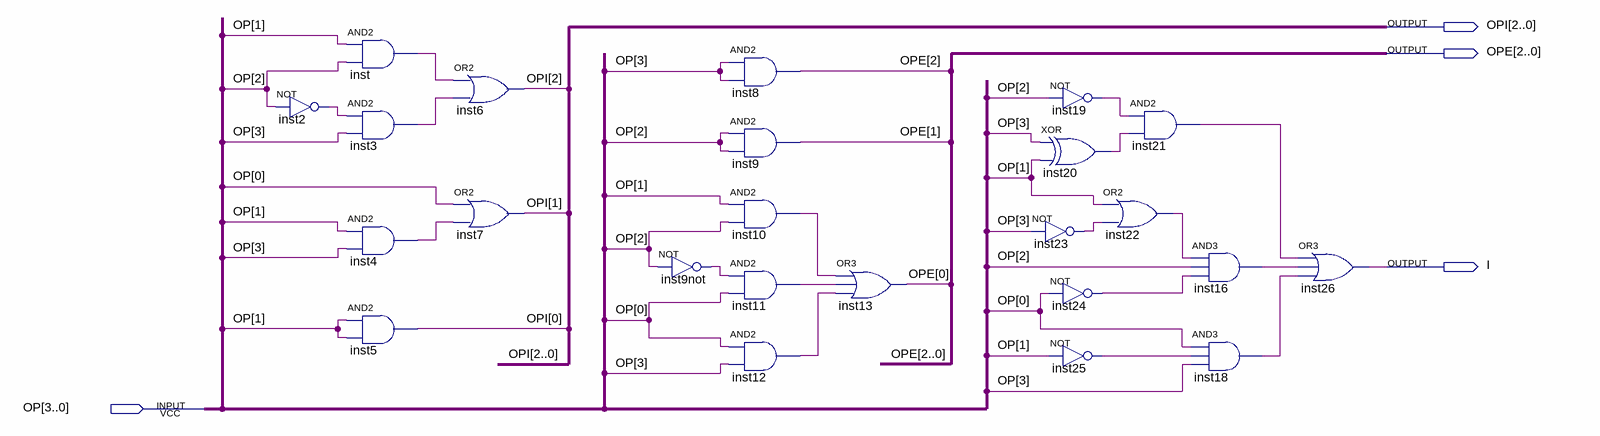
[diagram p0: schematic sheet]
// Quartus schematic DecOp.bdf as structural Verilog: 24 symbols, 4 pins
module DecOp (
  input  [3:0] OP,
  output [2:0] OPI,
  output [2:0] OPE,
  output I
);

  wire inst2_out, inst3_out, inst4_out, inst9not_out, inst10_out, inst11_out, inst12_out, inst16_out,
       inst18_out, inst19_out, inst20_out, inst21_out, inst22_out, inst23_out, inst24_out, inst25_out,
       inst_out;

  not inst2 (inst2_out, OP[2]);
  and inst (inst_out, OP[1], OP[2]);
  and inst3 (inst3_out, inst2_out, OP[3]);
  and inst4 (inst4_out, OP[1], OP[3]);
  and inst5 (OPI[0], OP[1], OP[1]);
  or inst6 (OPI[2], inst_out, inst3_out);
  or inst7 (OPI[1], OP[0], inst4_out);
  not inst9not (inst9not_out, OP[2]);
  and inst8 (OPE[2], OP[3], OP[3]);
  and inst9 (OPE[1], OP[2], OP[2]);
  and inst10 (inst10_out, OP[1], OP[2]);
  and inst11 (inst11_out, inst9not_out, OP[0]);
  and inst12 (inst12_out, OP[0], OP[3]);
  or inst13 (OPE[0], inst10_out, inst11_out, inst12_out);
  not inst19 (inst19_out, OP[2]);
  xor inst20 (inst20_out, OP[3], OP[1]);
  not inst23 (inst23_out, OP[3]);
  not inst24 (inst24_out, OP[0]);
  not inst25 (inst25_out, OP[1]);
  and inst21 (inst21_out, inst19_out, inst20_out);
  or inst22 (inst22_out, OP[1], inst23_out);
  and inst16 (inst16_out, inst22_out, OP[2], inst24_out);
  and inst18 (inst18_out, OP[0], inst25_out, OP[3]);
  or inst26 (I, inst21_out, inst16_out, inst18_out);
endmodule
